# EAGLE design 555-PWM-Motor-Speed-Controller-alt (EAGLE 7.2.0)
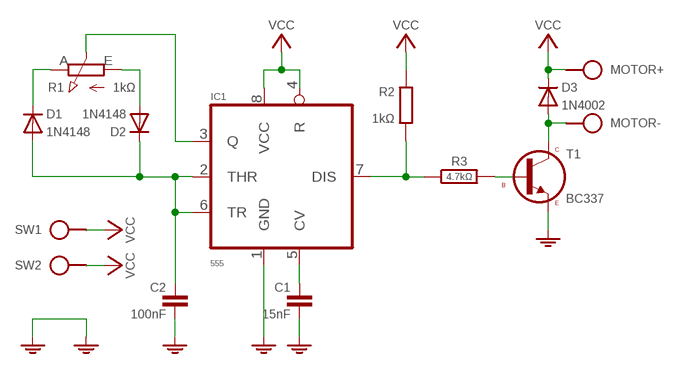
[diagram p0: schematic, sheet 1]

## Parts
C1  15nF  C050-020X036/V  [C050-020X036/V]
C2  100nF  C025-015X024/V  [C025-015X024/V]
D1  1N4148  DIODE34-5V  [DO34-5V]
D2  1N4148  DIODE34-5-V  [DO34-5-V]
D3  1N4002  DIODE34-5V  [DO34-5V]
IC1  555  555_ALT3  [DIL08]
MOTOR  SPAD+-+-  [SPAD+-]
PWR  VCC_GNDR  [SPAD+-]
R1  1kΩ  POT-H-3P/H  [CONN-3P/H]
R2  1kΩ  R0204/10-V  [0204/10-V]
R3  4.7kΩ  R-H0204/10-V  [0204/10-V]
SW1  SPAD-1  [SPAD]
SW2  SPAD-1  [SPAD]
T1  BC337  BC337CBE  [TO92-CBE]

## Nets
GND: C1.2 C2.2 IC1.1(GND) PWR.1 T1.3(E)
N$1: C1.1 IC1.5(CV)
N$2: IC1.7(DIS) R2.2 R3.1
N$3: IC1.3(Q) R1.2(S)
N$4: D1.C R1.3(E)
N$5: D2.A R1.1(A)
N$6: C2.1 D1.A D2.C IC1.2(THR) IC1.6(TR)
N$7: R3.2 T1.2(B)
N$8: D3.A MOTOR.1 T1.1(C)
PWR+: PWR.2 SW1.1
VCC: D3.C IC1.4(R) IC1.8(VCC) MOTOR.2 R2.1 SW2.1

## Library data of the parts
C1 C2 = c:C: CAPACITOR, European symbol
D1-D3 = d:DIODE
IC1 = ic:*555_ALT3
MOTOR = pad:SPAD+-
PWR = pad:VCC_GND
R1 = r:POT-H
R2 = r:R: RESISTOR, European symbol
R3 = r:R-H
SW1 SW2 = pad:SPAD-1
T1 = t:BC337

## Board
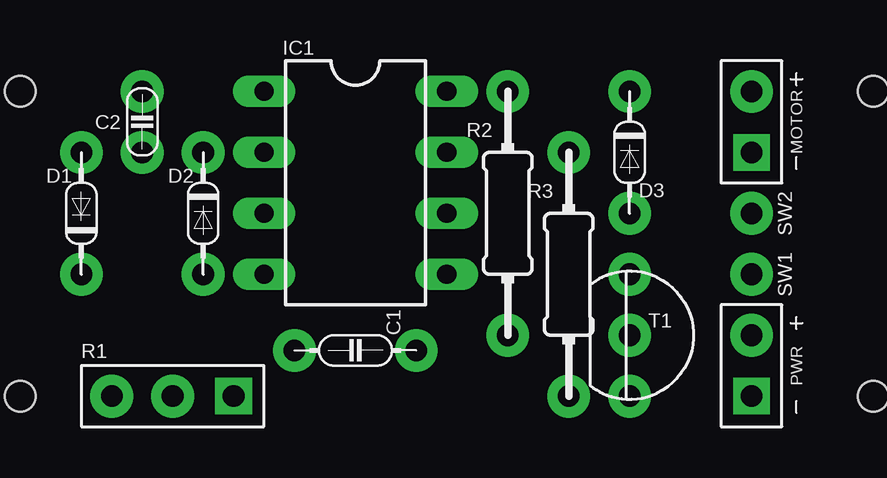
[diagram p1: board, top side]
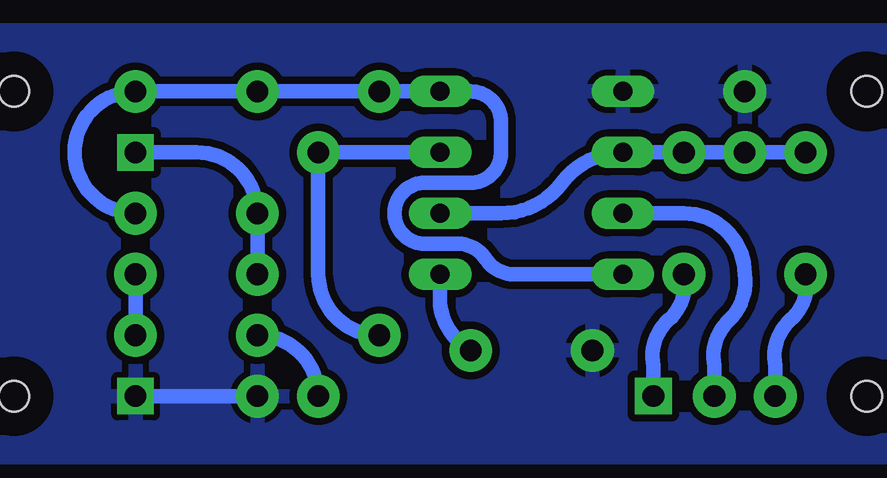
[diagram p2: board, bottom side, seen from below]

No outline drawn. Coordinates in mm, seen from the top.
Copper layers (1*16): Top 0.035mm / dielectric 1.5mm / Bottom 0.035mm
Design rules "default": minimum track width 10mil, minimum drill 24mil, track to track 8mil, track to pad 8mil, pad to pad 8mil, via to via 8mil, smd to smd 8mil, copper to edge 40mil, drill to drill 8mil, minimum pad ring 10mil, minimum via ring 8mil, stop-mask expansion 4mil, vias tented up to drill 0mil, thermal gap 10mil
Holes 1.27 mm at 2.54,17.78 2.54,5.08 38.1,17.78 38.1,5.08

### Footprints (pad centres in the part's own frame; a part is rotated, then mirrored left to right if it is on the bottom)
C050-020X036/V = drill 0.9 pad 1.778: 1 0,2.54; 2 0,-2.54
C025-015X024/V = drill 0.9 pad 1.778: 1 0,-1.27; 2 0,1.27
DO34-5V = drill 0.9 pad 1.778: A 0,2.54; C 0,-2.54
DO34-5-V = drill 0.9 pad 1.778: A 0,-2.54; C 0,2.54
DIL08 = drill 0.8 pad 1.27 long: 1 -3.81,3.81; 2 -3.81,1.27; 3 -3.81,-1.27; 4 -3.81,-3.81; 5 3.81,-3.81; 6 3.81,-1.27; 7 3.81,1.27; 8 3.81,3.81
SPAD+- = drill 0.9 pad 1.524 square: 1 0,-1.27 | drill 0.9 pad 1.778: 2 0,1.27
CONN-3P/H = drill 0.9 pad 1.524 square: 1 2.54,0 | drill 0.9 pad 1.778: 2 0,0; 3 -2.54,0
0204/10-V = drill 0.9 pad 1.778: 1 0,5.08; 2 0,-5.08
SPAD = drill 0.9 pad 1.778: 1 0,0
TO92-CBE = drill 0.9 pad 1.778: 1 0,2.54; 2 0,0; 3 0,-2.54

### Placement (x,y rotation side)
C1  16.51,6.99 270 top
C2  7.62,16.51 0 top
D1  5.08,12.7 0 top
D2  10.16,12.7 0 top
D3  27.94,15.24 180 top
IC1  16.51,13.97 0 top
MOTOR  33.02,16.51 0 top
PWR  33.02,6.35 0 top
R1  8.89,5.08 0 top
R2  22.86,12.7 0 top
R3  25.4,10.16 0 top
SW1  33.02,10.16 180 top
SW2  33.02,12.7 180 top
T1  27.94,7.62 0 top

### Tracks (layer width: path | path; a pad name or v marks a point on that pad's centre or on a via)
GND
  Bottom 0.61: T1.3 PWR.1
  pour Bottom (isolate 0.305): 0,20.32 0,2.54 40.64,2.54 40.64,20.32
N$1
  Bottom 0.61: IC1.5 20.32,8.89 arc-53 C1.1
N$2
  Bottom 0.61: IC1.7 R3.1 25.4,10.16 arc-90 R2.2
N$3
  Bottom 0.61: IC1.3 10.16,12.7 arc90 7.62,10.16 arc53 8.26,8.26 arc-60 8.89,6.35 R1.2
N$4
  Bottom 0.61: D1.C arc60 5.71,8.26 arc-60 6.35,6.35 R1.3
N$5
  Bottom 0.61: R1.1 11.43,6.35 arc60 10.79,8.26 arc-60 D2.A
N$6
  Bottom 0.61: IC1.6 17.78,12.7 arc-53 15.24,13.97 arc53 IC1.2 D2.C C2.1 D1.A
N$7
  Bottom 0.61: R3.2 arc-90 T1.2
N$8
  Bottom 0.61: MOTOR.1 30.48,15.24 arc90 D3.A T1.1
PWR+
  Bottom 0.61: PWR.2 SW1.1
VCC
  Bottom 0.61: IC1.4 17.14,10.16 arc60 18.41,10.79 arc-60 19.68,11.43 20.95,11.43 arc90 22.23,12.7 arc90 20.95,13.97 19.05,13.97 arc-90 17.78,15.24 17.78,16.51 arc-90 19.05,17.78 IC1.8 R2.1 D3.C MOTOR.2 arc-90 35.56,15.24 arc-90 SW2.1